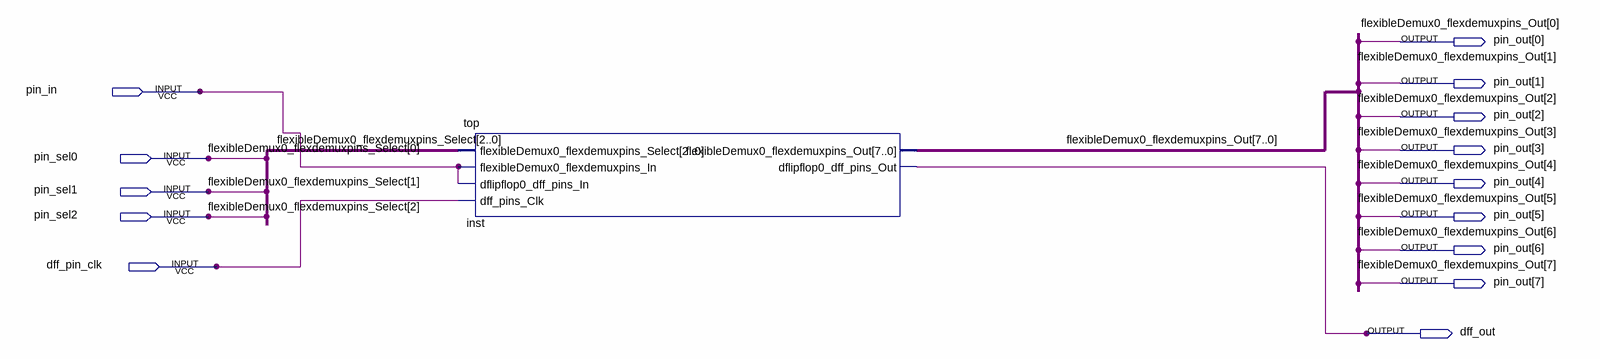
[diagram p0: schematic sheet]
// Quartus schematic topschematic.bdf as structural Verilog: 1 symbols, 14 pins
module topschematic (
  input  pin_in,
  input  pin_sel0,
  input  pin_sel1,
  input  pin_sel2,
  input  dff_pin_clk,
  output [7:0] pin_out,
  output dff_out
);

  top inst (
    .flexibleDemux0_flexdemuxpins_Select({pin_sel2, pin_sel1, pin_sel0}),
    .flexibleDemux0_flexdemuxpins_In(pin_in), .dflipflop0_dff_pins_In(pin_in), .dff_pins_Clk(dff_pin_clk),
    .flexibleDemux0_flexdemuxpins_Out(pin_out), .dflipflop0_dff_pins_Out(dff_out));

  // Other names for the same wires on the sheet: flexibleDemux0_flexdemuxpins_Out[7:0] = pin_out;
  //   flexibleDemux0_flexdemuxpins_Select[2:0] = {pin_sel2, pin_sel1, pin_sel0}
endmodule
